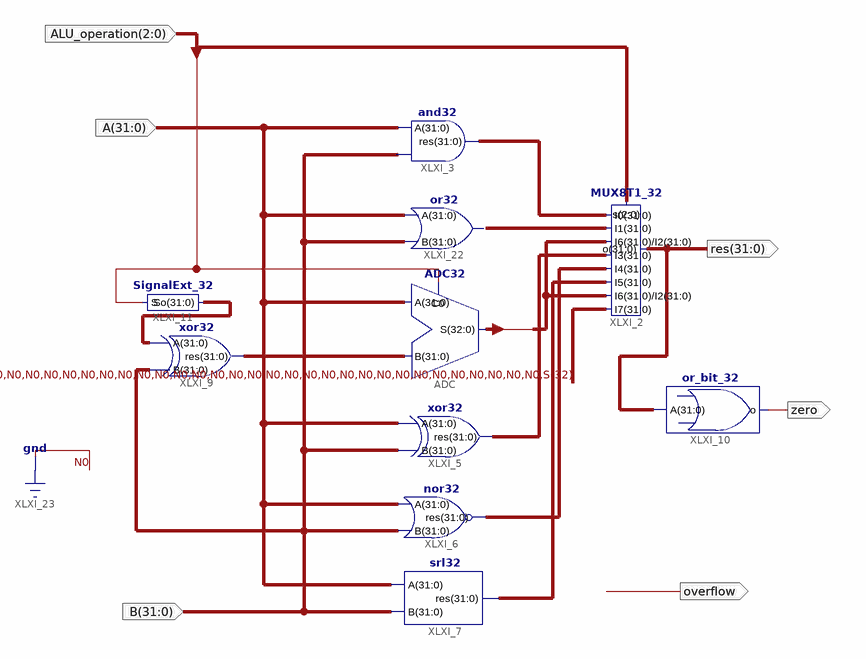
[diagram p0: schematic sheet 1]
// Xilinx ISE schematic ALU.sch (kintex7) as structural Verilog: 10 symbols, 6 ports
module ALU (
  input  [31:0] A,
  input  [31:0] B,
  input  [2:0] ALU_operation,
  output [31:0] res,
  output zero,
  output overflow
);

  wire [31:0] XLXN_11, XLXN_14, XLXN_18, XLXN_23, XLXN_35, XLXN_66, XLXN_67;
  wire [32:0] S;

  xor32 XLXI_9 (.A(XLXN_35), .B(B), .res(XLXN_23));
  MUX8T1_32 XLXI_2 (
    .s(ALU_operation), .I7({{31{1'b0}}, S[32]}), .I6(S[31:0]), .I5(XLXN_18), .I4(XLXN_67), .I3(XLXN_66),
    .I2(S[31:0]), .I1(XLXN_11), .I0(XLXN_14), .o(res));
  srl32 XLXI_7 (.A(A), .B(B), .res(XLXN_18));
  nor32 XLXI_6 (.res(XLXN_67), .A(A), .B(B));
  xor32 XLXI_5 (.A(A), .B(B), .res(XLXN_66));
  ADC32 ADC (.B(XLXN_23), .A(A), .C0(ALU_operation[2]), .S(S));
  and32 XLXI_3 (.res(XLXN_14), .A(A), .B(B));
  or_bit_32 XLXI_10 (.o(zero), .A(res));
  SignalExt_32 XLXI_11 (.So(XLXN_35), .S(ALU_operation[2]));
  or32 XLXI_22 (.res(XLXN_11), .A(A), .B(B));
endmodule
